# Altium schematic sheet crosstalk-2.SchDoc
size A4; SheetNumber: 1; SheetTotal: 1
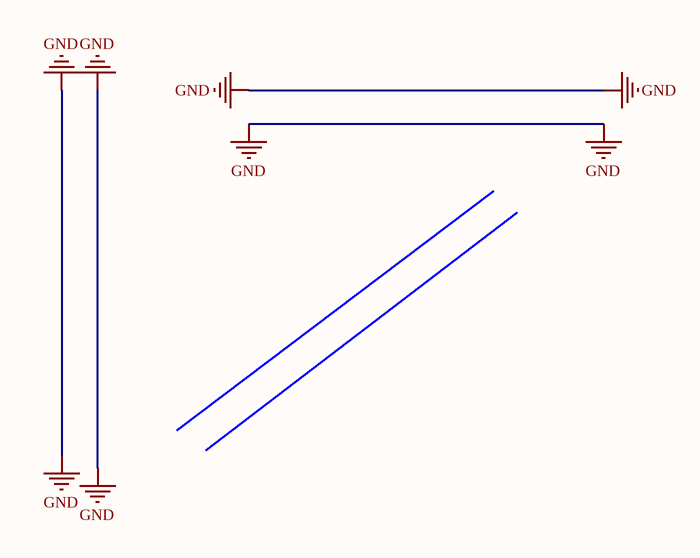
[diagram p0: crosstalk-2.SchDoc]

## Notes on the sheet
- TITLE:
- DOCUMENT NAME:
- AUTHOR :
- REVIEWER:
- This document is created by/ for Mitai. Any further questions can be asked through
- Sheet
- PART NO.:
- of
- DATE:
- *
- TEMPLATE:
- team@mitai.ai.
- A4
- Contact Address:Rosenheimer Straße 116b,81669, München.